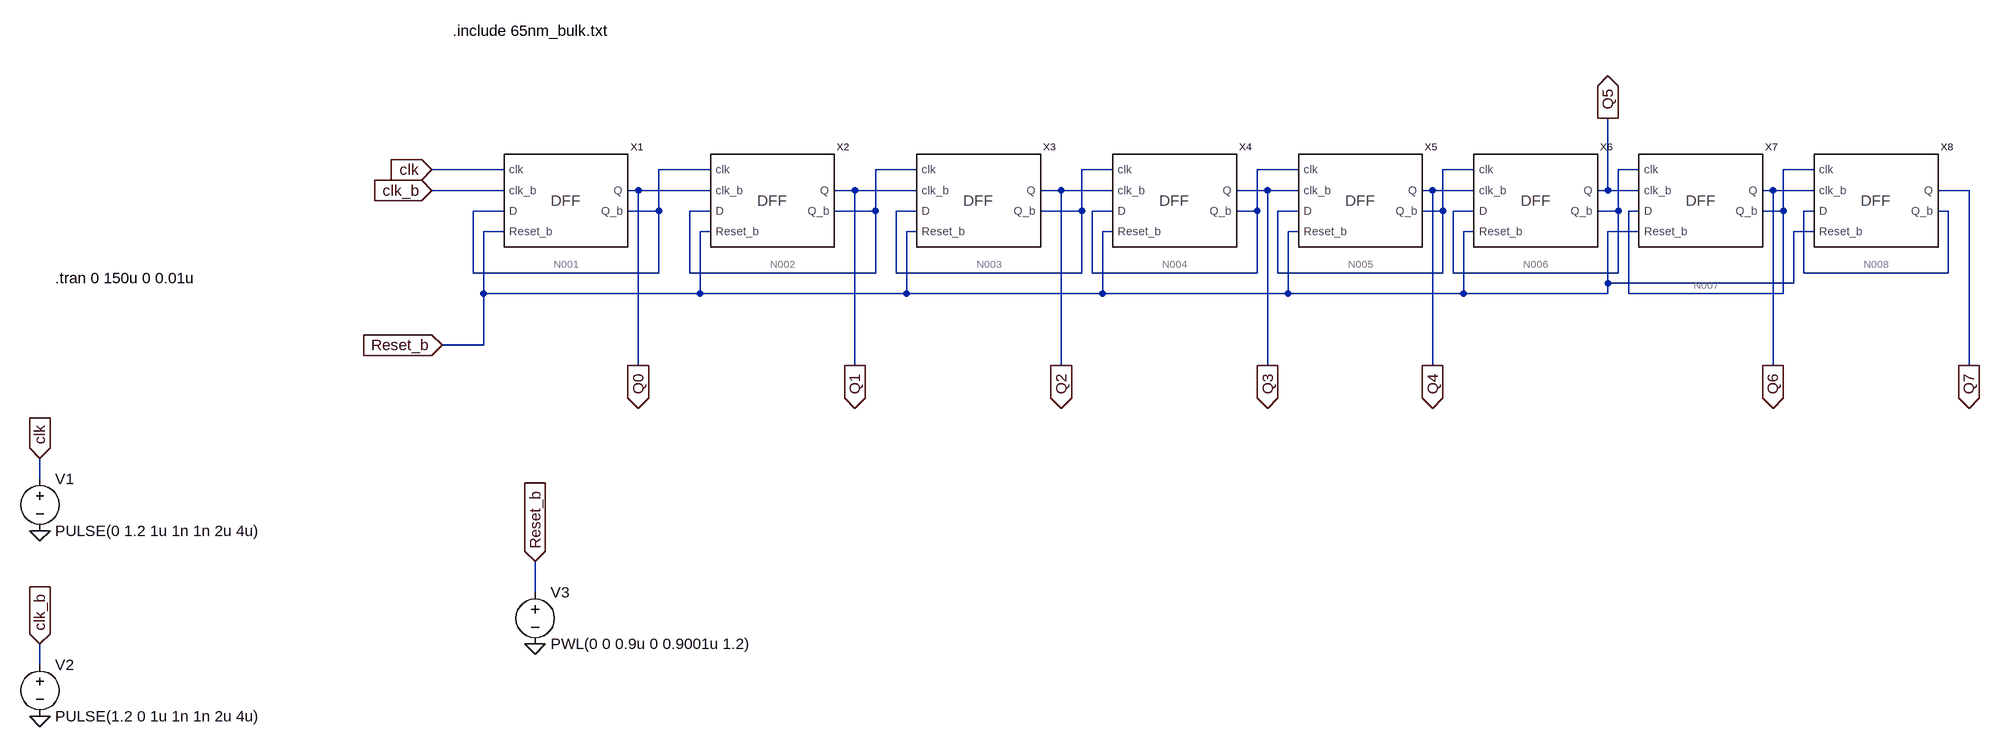
[diagram p0: schematic final_counter.asc]
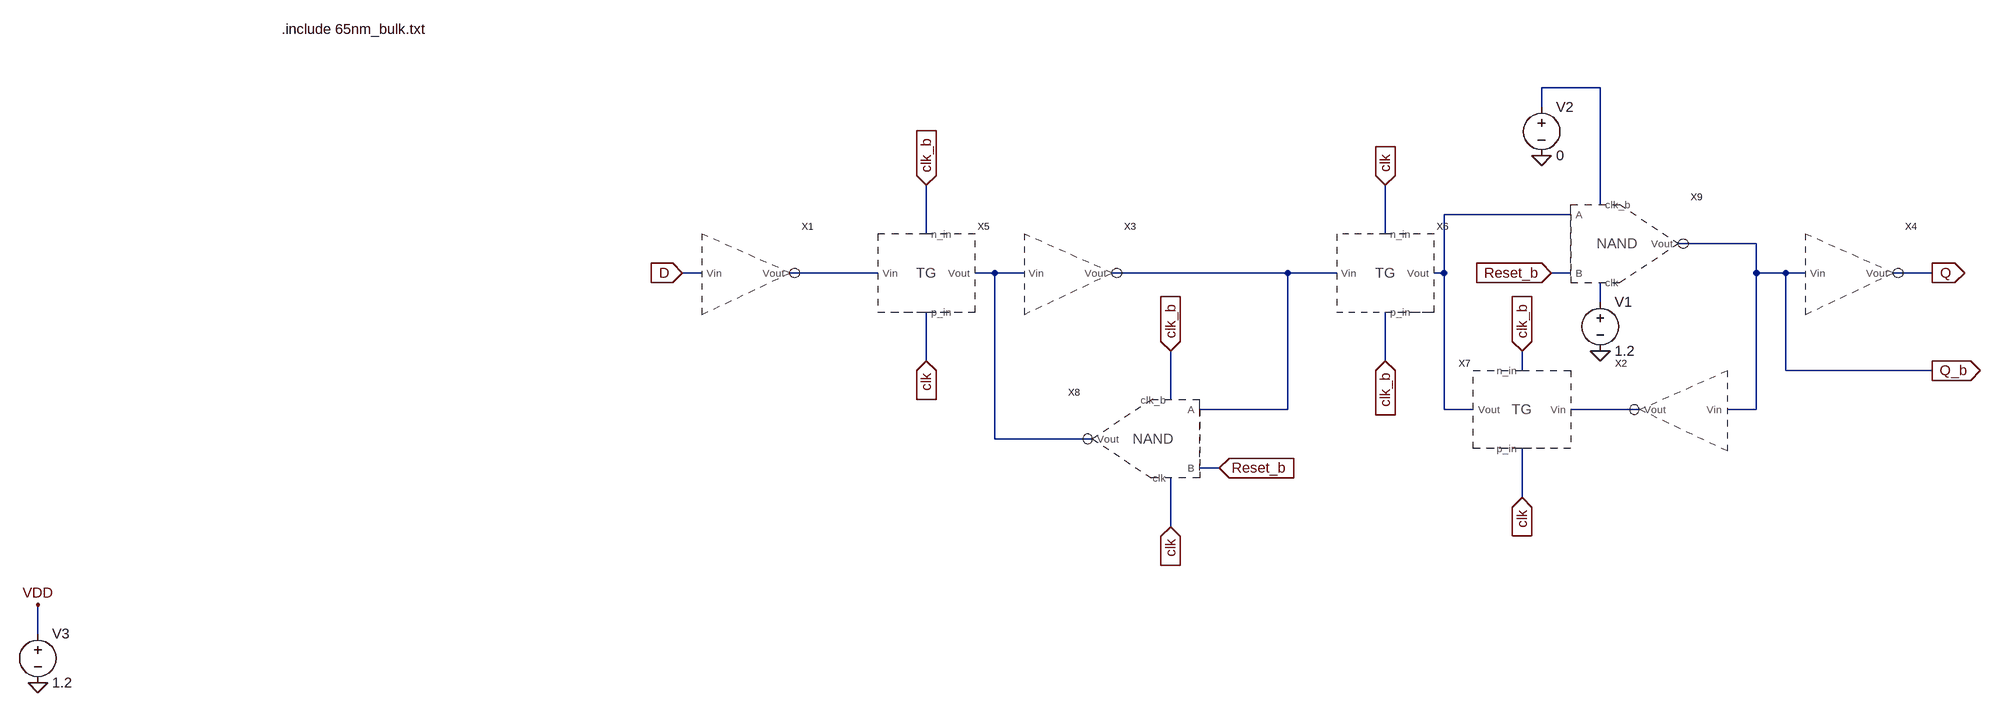
[diagram p1: sub-circuit def_res_sym_2.asc]
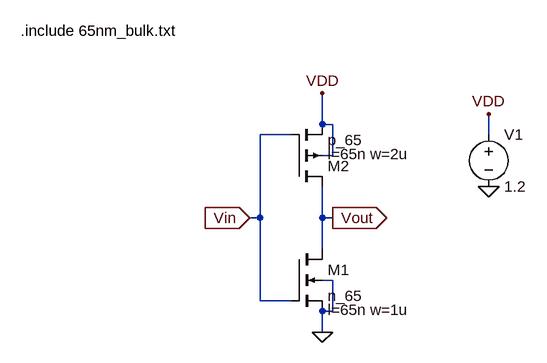
[diagram p2: sub-circuit inverter.asc]
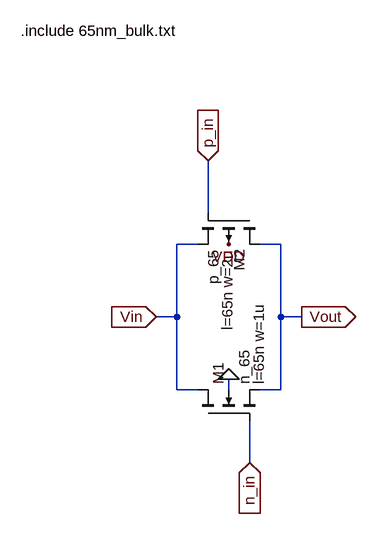
[diagram p3: sub-circuit transmission_gate.asc]
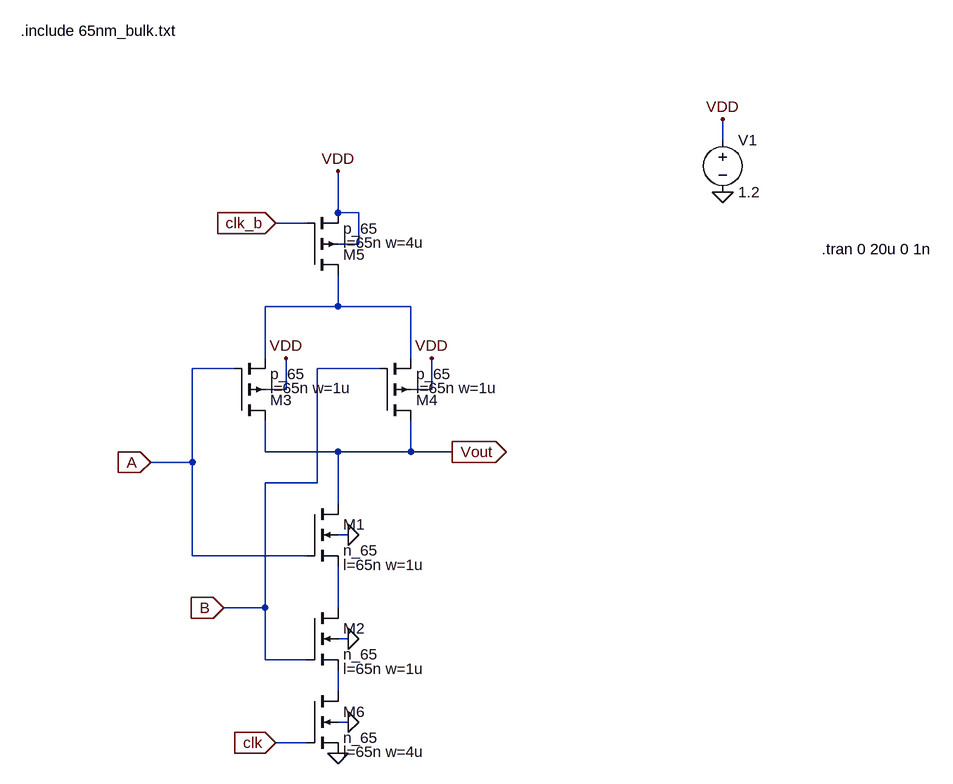
[diagram p4: sub-circuit nand_sym.asc]
final_counter.asc, the LTspice schematic file:
Version 4
SHEET 1 2428 1184
WIRE 96 320 -16 320
WIRE 416 320 336 320
WIRE 736 320 672 320
WIRE 1040 320 992 320
WIRE 1328 320 1264 320
WIRE 1600 320 1552 320
WIRE 1856 320 1824 320
WIRE 2128 320 2080 320
WIRE 96 352 -16 352
WIRE 304 352 288 352
WIRE 416 352 304 352
WIRE 640 352 608 352
WIRE 736 352 640 352
WIRE 960 352 928 352
WIRE 1040 352 960 352
WIRE 1280 352 1232 352
WIRE 1328 352 1280 352
WIRE 1536 352 1520 352
WIRE 1600 352 1536 352
WIRE 1808 352 1808 240
WIRE 1808 352 1792 352
WIRE 1856 352 1808 352
WIRE 2064 352 2048 352
WIRE 2128 352 2064 352
WIRE 2368 352 2320 352
WIRE 96 384 48 384
WIRE 336 384 336 320
WIRE 336 384 288 384
WIRE 416 384 384 384
WIRE 672 384 672 320
WIRE 672 384 608 384
WIRE 736 384 704 384
WIRE 992 384 992 320
WIRE 992 384 928 384
WIRE 1040 384 1008 384
WIRE 1264 384 1264 320
WIRE 1264 384 1232 384
WIRE 1328 384 1296 384
WIRE 1552 384 1552 320
WIRE 1552 384 1520 384
WIRE 1600 384 1568 384
WIRE 1824 384 1824 320
WIRE 1824 384 1792 384
WIRE 1856 384 1840 384
WIRE 2080 384 2080 320
WIRE 2080 384 2048 384
WIRE 2128 384 2112 384
WIRE 2336 384 2320 384
WIRE 96 416 64 416
WIRE 416 416 400 416
WIRE 736 416 720 416
WIRE 1040 416 1024 416
WIRE 1328 416 1312 416
WIRE 1600 416 1584 416
WIRE 1856 416 1808 416
WIRE 2128 416 2096 416
WIRE 48 480 48 384
WIRE 336 480 336 384
WIRE 336 480 48 480
WIRE 384 480 384 384
WIRE 672 480 672 384
WIRE 672 480 384 480
WIRE 704 480 704 384
WIRE 992 480 992 384
WIRE 992 480 704 480
WIRE 1008 480 1008 384
WIRE 1264 480 1264 384
WIRE 1264 480 1008 480
WIRE 1296 480 1296 384
WIRE 1552 480 1552 384
WIRE 1552 480 1296 480
WIRE 1568 480 1568 384
WIRE 1824 480 1824 384
WIRE 1824 480 1568 480
WIRE 2112 480 2112 384
WIRE 2336 480 2336 384
WIRE 2336 480 2112 480
WIRE 1808 496 1808 416
WIRE 2096 496 2096 416
WIRE 2096 496 1808 496
WIRE 64 512 64 416
WIRE 400 512 400 416
WIRE 400 512 64 512
WIRE 720 512 720 416
WIRE 720 512 400 512
WIRE 1024 512 1024 416
WIRE 1024 512 720 512
WIRE 1312 512 1312 416
WIRE 1312 512 1024 512
WIRE 1584 512 1584 416
WIRE 1584 512 1312 512
WIRE 1808 512 1808 496
WIRE 1808 512 1584 512
WIRE 1840 512 1840 384
WIRE 2080 512 2080 384
WIRE 2080 512 1840 512
WIRE 64 592 64 512
WIRE 64 592 0 592
WIRE 304 624 304 352
WIRE 640 624 640 352
WIRE 960 624 960 352
WIRE 1280 624 1280 352
WIRE 1536 624 1536 352
WIRE 2064 624 2064 352
WIRE 2368 624 2368 352
WIRE -624 800 -624 768
WIRE 144 976 144 928
WIRE -624 1088 -624 1056
FLAG 304 624 Q0
IOPIN 304 624 Out
FLAG 640 624 Q1
IOPIN 640 624 Out
FLAG 960 624 Q2
IOPIN 960 624 Out
FLAG -16 320 clk
IOPIN -16 320 In
FLAG -16 352 clk_b
IOPIN -16 352 In
FLAG 0 592 Reset_b
IOPIN 0 592 In
FLAG -624 768 clk
IOPIN -624 768 In
FLAG -624 880 0
FLAG -624 1056 clk_b
IOPIN -624 1056 In
FLAG -624 1168 0
FLAG 144 928 Reset_b
IOPIN 144 928 In
FLAG 144 1056 0
FLAG 1280 624 Q3
IOPIN 1280 624 Out
FLAG 1536 624 Q4
IOPIN 1536 624 Out
FLAG 2064 624 Q6
IOPIN 2064 624 Out
FLAG 2368 624 Q7
IOPIN 2368 624 Out
FLAG 1808 240 Q5
IOPIN 1808 240 Out
SYMBOL def_res_sym_2 192 368 R0
SYMATTR InstName X1
SYMBOL def_res_sym_2 512 368 R0
SYMATTR InstName X2
SYMBOL def_res_sym_2 832 368 R0
SYMATTR InstName X3
SYMBOL Voltage -624 784 R0
SYMATTR InstName V1
SYMATTR Value PULSE(0 1.2 1u 1n 1n 2u 4u)
SYMBOL Voltage -624 1072 R0
SYMATTR InstName V2
SYMATTR Value PULSE(1.2 0 1u 1n 1n 2u 4u)
SYMBOL Voltage 144 960 R0
SYMATTR InstName V3
SYMATTR Value PWL(0 0 0.9u 0 0.9001u 1.2)
SYMBOL def_res_sym_2 1136 368 R0
SYMATTR InstName X4
SYMBOL def_res_sym_2 1424 368 R0
SYMATTR InstName X5
SYMBOL def_res_sym_2 1696 368 R0
SYMATTR InstName X6
SYMBOL def_res_sym_2 1952 368 R0
SYMATTR InstName X7
SYMBOL def_res_sym_2 2224 368 R0
SYMATTR InstName X8
TEXT 16 104 Left 2 !.include 65nm_bulk.txt
TEXT -600 488 Left 2 !.tran 0 150u 0 0.01u

def_res_sym_2.asc, the sub-circuit schematic file:
Version 4
SHEET 1 1980 960
WIRE 1344 -32 1248 -32
WIRE 1248 0 1248 -32
WIRE 1344 160 1344 -32
WIRE 1296 176 1088 176
WIRE 240 208 240 128
WIRE 992 208 992 128
WIRE 1600 224 1472 224
WIRE -128 272 -160 272
WIRE 160 272 16 272
WIRE 352 272 320 272
WIRE 400 272 352 272
WIRE 832 272 544 272
WIRE 912 272 832 272
WIRE 1088 272 1088 176
WIRE 1088 272 1072 272
WIRE 1296 272 1264 272
WIRE 1600 272 1600 224
WIRE 1648 272 1600 272
WIRE 1680 272 1648 272
WIRE 1888 272 1824 272
WIRE 1344 320 1344 288
WIRE 240 416 240 336
WIRE 992 416 992 336
WIRE 1216 432 1216 400
WIRE 1648 432 1648 272
WIRE 1888 432 1648 432
WIRE 640 480 640 400
WIRE 832 496 832 272
WIRE 832 496 688 496
WIRE 1088 496 1088 272
WIRE 1136 496 1088 496
WIRE 1408 496 1296 496
WIRE 1600 496 1600 272
WIRE 1600 496 1552 496
WIRE 352 544 352 272
WIRE 512 544 352 544
WIRE 720 592 688 592
WIRE 1216 640 1216 560
WIRE 640 688 640 608
WIRE -1216 864 -1216 816
FLAG 240 128 clk_b
IOPIN 240 128 In
FLAG 240 416 clk
IOPIN 240 416 In
FLAG 992 128 clk
IOPIN 992 128 In
FLAG 992 416 clk_b
IOPIN 992 416 In
FLAG 1216 400 clk_b
IOPIN 1216 400 In
FLAG 1216 640 clk
IOPIN 1216 640 In
FLAG -160 272 D
IOPIN -160 272 In
FLAG 1888 272 Q
IOPIN 1888 272 Out
FLAG 640 688 clk
IOPIN 640 688 In
FLAG 640 400 clk_b
IOPIN 640 400 In
FLAG 720 592 Reset_b
IOPIN 720 592 In
FLAG 1264 272 Reset_b
IOPIN 1264 272 In
FLAG 1344 400 0
FLAG 1248 80 0
FLAG -1216 816 VDD
FLAG -1216 944 0
FLAG 1888 432 Q_b
IOPIN 1888 432 Out
SYMBOL inverter -64 272 R0
SYMATTR InstName X1
SYMBOL inverter 1488 496 M0
SYMATTR InstName X2
SYMBOL inverter 464 272 R0
SYMATTR InstName X3
SYMBOL inverter 1744 272 R0
SYMATTR InstName X4
SYMBOL transmission_gate 240 272 R0
SYMATTR InstName X5
SYMBOL transmission_gate 992 272 R0
SYMATTR InstName X6
SYMBOL transmission_gate 1216 496 M0
SYMATTR InstName X7
SYMBOL nand_sym 608 544 M0
SYMATTR InstName X8
SYMBOL nand_sym 1376 224 R0
SYMATTR InstName X9
SYMBOL Voltage 1344 304 R0
SYMATTR InstName V1
SYMATTR Value 1.2
SYMBOL Voltage 1248 -16 R0
SYMATTR InstName V2
SYMATTR Value 0
SYMBOL Voltage -1216 848 R0
SYMATTR InstName V3
SYMATTR Value 1.2
TEXT -816 -128 Left 2 !.include 65nm_bulk.txt

inverter.asc, the sub-circuit schematic file:
Version 4
SHEET 1 880 680
WIRE 400 224 400 176
WIRE 416 224 400 224
WIRE 352 240 304 240
WIRE 656 240 656 208
WIRE 416 272 416 224
WIRE 416 272 400 272
WIRE 304 368 304 240
WIRE 304 368 288 368
WIRE 400 368 400 320
WIRE 416 368 400 368
WIRE 400 416 400 368
WIRE 416 464 400 464
WIRE 304 496 304 368
WIRE 352 496 304 496
WIRE 416 512 416 464
WIRE 416 512 400 512
WIRE 400 544 400 512
FLAG 400 544 0
FLAG 400 176 VDD
FLAG 656 208 VDD
FLAG 656 320 0
FLAG 288 368 Vin
IOPIN 288 368 In
FLAG 416 368 Vout
IOPIN 416 368 Out
SYMBOL nmos4 352 416 R0
WINDOW 123 56 94 Left 2
SYMATTR InstName M1
SYMATTR Value n_65
SYMATTR Value2 l=65n w=1u
SYMBOL pmos4 352 320 M180
WINDOW 123 56 50 Left 2
SYMATTR InstName M2
SYMATTR Value p_65
SYMATTR Value2 l=65n w=2u
SYMBOL Voltage 656 224 R0
SYMATTR InstName V1
SYMATTR Value 1.2
TEXT -64 80 Left 2 !.include 65nm_bulk.txt

transmission_gate.asc, the sub-circuit schematic file:
Version 4
SHEET 1 880 924
WIRE 64 368 64 288
WIRE 48 416 16 416
WIRE 176 416 144 416
WIRE 16 528 16 416
WIRE 16 528 -16 528
WIRE 176 528 176 416
WIRE 208 528 176 528
WIRE 16 640 16 528
WIRE 48 640 16 640
WIRE 96 640 96 624
WIRE 176 640 176 528
WIRE 176 640 144 640
WIRE 128 752 128 688
FLAG 96 624 0
FLAG 96 416 VDD
FLAG 128 752 n_in
IOPIN 128 752 In
FLAG 64 288 p_in
IOPIN 64 288 In
FLAG -16 528 Vin
IOPIN -16 528 In
FLAG 208 528 Vout
IOPIN 208 528 Out
SYMBOL nmos4 48 688 R270
WINDOW 123 56 94 Left 2
SYMATTR Value2 l=65n w=1u
SYMATTR InstName M1
SYMATTR Value n_65
SYMBOL pmos4 144 368 R90
WINDOW 123 56 50 Left 2
SYMATTR Value2 l=65n w=2u
SYMATTR InstName M2
SYMATTR Value p_65
TEXT -224 88 Left 2 !.include 65nm_bulk.txt

nand_sym.asc, the sub-circuit schematic file:
Version 4
SHEET 1 1728 992
WIRE 592 -240 592 -272
WIRE 0 -128 0 -192
WIRE 32 -128 0 -128
WIRE -48 -112 -96 -112
WIRE 32 -80 32 -128
WIRE 32 -80 0 -80
WIRE 0 16 0 -32
WIRE 0 16 -112 16
WIRE 112 16 0 16
WIRE -112 96 -112 16
WIRE 112 96 112 16
WIRE -160 112 -224 112
WIRE 64 112 -32 112
WIRE -80 144 -80 96
WIRE -80 144 -112 144
WIRE 144 144 144 96
WIRE 144 144 112 144
WIRE -112 240 -112 192
WIRE 0 240 -112 240
WIRE 112 240 112 192
WIRE 112 240 0 240
WIRE 176 240 112 240
WIRE -224 256 -224 112
WIRE -224 256 -288 256
WIRE -32 288 -32 112
WIRE -32 288 -112 288
WIRE 0 320 0 240
WIRE 16 368 0 368
WIRE -224 400 -224 256
WIRE -48 400 -224 400
WIRE -112 480 -112 288
WIRE -112 480 -176 480
WIRE 0 480 0 416
WIRE 16 528 0 528
WIRE -112 560 -112 480
WIRE -48 560 -112 560
WIRE 0 608 0 576
WIRE 16 656 0 656
WIRE -48 688 -96 688
FLAG 0 -192 VDD
FLAG 16 368 0
FLAG 16 528 0
FLAG -288 256 A
IOPIN -288 256 In
FLAG -176 480 B
IOPIN -176 480 In
FLAG -80 96 VDD
FLAG 144 96 VDD
FLAG 16 656 0
FLAG 0 704 0
FLAG -96 -112 clk_b
IOPIN -96 -112 In
FLAG -96 688 clk
IOPIN -96 688 In
FLAG 176 240 Vout
IOPIN 176 240 Out
FLAG 592 -272 VDD
FLAG 592 -160 0
SYMBOL nmos4 -48 320 R0
WINDOW 123 56 94 Left 2
SYMATTR Value2 l=65n w=1u
SYMATTR InstName M1
SYMATTR Value n_65
SYMBOL nmos4 -48 480 R0
WINDOW 123 56 94 Left 2
SYMATTR Value2 l=65n w=1u
SYMATTR InstName M2
SYMATTR Value n_65
SYMBOL pmos4 -160 192 M180
WINDOW 123 56 50 Left 2
SYMATTR Value2 l=65n w=1u
SYMATTR InstName M3
SYMATTR Value p_65
SYMBOL pmos4 64 192 M180
WINDOW 123 56 50 Left 2
SYMATTR Value2 l=65n w=1u
SYMATTR InstName M4
SYMATTR Value p_65
SYMBOL pmos4 -48 -32 M180
WINDOW 123 56 50 Left 2
SYMATTR Value2 l=65n w=4u
SYMATTR InstName M5
SYMATTR Value p_65
SYMBOL nmos4 -48 608 R0
WINDOW 123 56 94 Left 2
SYMATTR Value2 l=65n w=4u
SYMATTR InstName M6
SYMATTR Value n_65
SYMBOL Voltage 592 -256 R0
SYMATTR InstName V1
SYMATTR Value 1.2
TEXT -488 -408 Left 2 !.include 65nm_bulk.txt
TEXT 744 -72 Left 2 !.tran 0 20u 0 1n

The netlist it stands for:
* final_counter.asc
XX1 clk clk_b N001 Reset_b Q0 N001 def_res_sym_2
XX2 N001 Q0 N002 Reset_b Q1 N002 def_res_sym_2
XX3 N002 Q1 N003 Reset_b Q2 N003 def_res_sym_2
V1 clk 0 PULSE(0 1.2 1u 1n 1n 2u 4u)
V2 clk_b 0 PULSE(1.2 0 1u 1n 1n 2u 4u)
V3 Reset_b 0 PWL(0 0 0.9u 0 0.9001u 1.2)
XX4 N003 Q2 N004 Reset_b Q3 N004 def_res_sym_2
XX5 N004 Q3 N005 Reset_b Q4 N005 def_res_sym_2
XX6 N005 Q4 N006 Reset_b Q5 N006 def_res_sym_2
XX7 N006 Q5 N007 Reset_b Q6 N007 def_res_sym_2
XX8 N007 Q6 N008 Reset_b Q7 N008 def_res_sym_2

* block symbol definitions
.subckt def_res_sym_2 clk clk_b D Reset_b Q Q_b
XX1 D N003 inverter
XX2 Q_b N007 inverter
XX3 N004 N005 inverter
XX4 Q_b Q inverter
XX5 clk_b clk N003 N004 transmission_gate
XX6 clk clk_b N005 N002 transmission_gate
XX7 clk_b clk N007 N002 transmission_gate
XX8 N005 Reset_b clk clk_b N004 nand_sym
XX9 N002 Reset_b N006 N001 Q_b nand_sym
V1 N006 0 1.2
V2 N001 0 0
V3 VDD 0 1.2
.include 65nm_bulk.txt
.ends def_res_sym_2

.subckt inverter Vin Vout
M1 Vout Vin 0 0 n_65 l=65n w=1u
M2 Vout Vin VDD VDD p_65 l=65n w=2u
V1 VDD 0 1.2
.include 65nm_bulk.txt
.ends inverter

.subckt transmission_gate n_in p_in Vin Vout
M1 Vin n_in Vout 0 n_65 l=65n w=1u
M2 Vout p_in Vin VDD p_65 l=65n w=2u
.include 65nm_bulk.txt
.ends transmission_gate

.subckt nand_sym A B clk clk_b Vout
M1 Vout A N002 0 n_65 l=65n w=1u
M2 N002 B N003 0 n_65 l=65n w=1u
M3 Vout A N001 VDD p_65 l=65n w=1u
M4 Vout B N001 VDD p_65 l=65n w=1u
M5 N001 clk_b VDD VDD p_65 l=65n w=4u
M6 N003 clk 0 0 n_65 l=65n w=4u
V1 VDD 0 1.2
.include 65nm_bulk.txt
.tran 0 20u 0 1n
.ends nand_sym

.model NMOS NMOS
.model PMOS PMOS
.lib standard.mos
.include 65nm_bulk.txt
.tran 0 150u 0 0.01u
.backanno
.end

* Results of the author's LTspice run, read from the files saved beside the schematic
* Operating Point, zero values left out:
*   V(n001) = 1.2 V
*   V(q0) = 38.98 µV
*   V(clk_b) = 1.2 V
*   V(n002) = 1.2 V
*   V(q1) = 38.98 µV
*   V(n003) = 1.2 V
*   V(q2) = 38.98 µV
*   V(n004) = 1.2 V
*   V(q3) = 38.98 µV
*   V(n005) = 1.2 V
*   V(q4) = 38.98 µV
*   V(n006) = 1.2 V
*   V(q5) = 38.98 µV
*   V(n007) = 1.2 V
*   V(q6) = 38.98 µV
*   V(n008) = 1.2 V
*   V(q7) = 37.16 µV
*   I(V1) = 7.029 nA
*   I(V2) = -57.52 nA
*   I(V3) = 1.477 nA
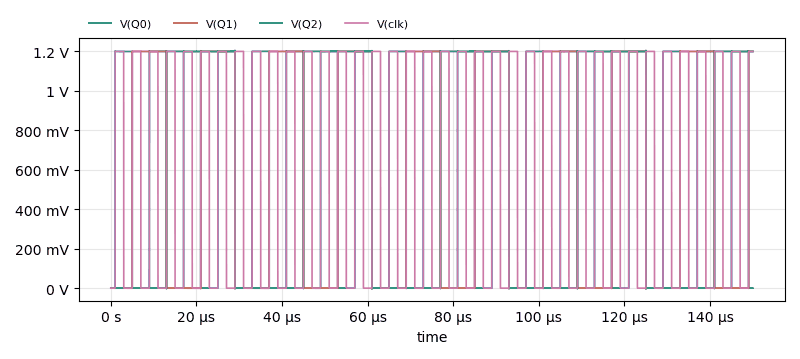
[diagram p5: Transient Analysis of final_counter.asc, plotted from the saved traces]
* Transient Analysis, 1 run:
*   V(Q0): min -2.926 mV, max 1.203 V, average 608 mV, rms 854.1 mV, last 42.48 µV
*   V(Q1): min -3.327 mV, max 1.203 V, average 584 mV, rms 837.1 mV, last 1.2 V
*   V(Q2): min -3.36 mV, max 1.205 V, average 584 mV, rms 837.1 mV, last 1.2 V
*   V(clk): min 0 V, max 1.2 V, average 600.3 mV, rms 848.7 mV, last 1.2 V